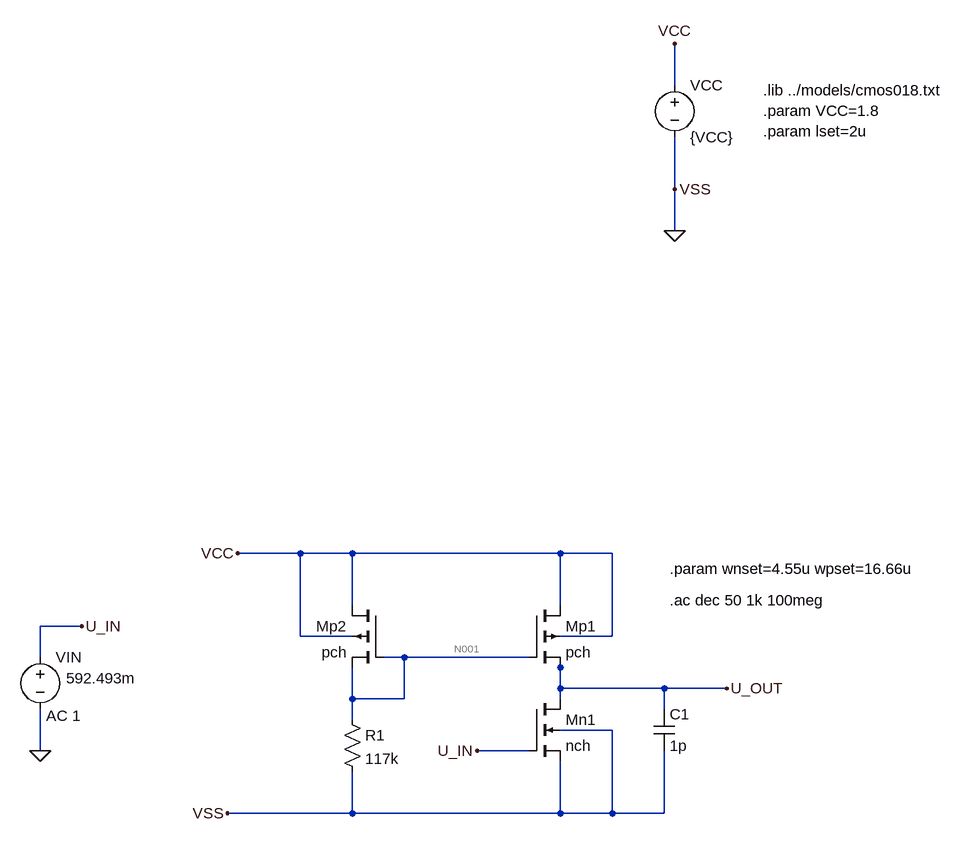
[diagram p0: schematic 4-2-2.asc]
4-2-2.asc, the LTspice schematic file:
Version 4
SHEET 1 7274800 2004
WIRE 1072 -544 1072 -608
WIRE 1072 -384 1072 -464
WIRE 1072 -320 1072 -384
WIRE 496 176 400 176
WIRE 576 176 496 176
WIRE 896 176 576 176
WIRE 976 176 896 176
WIRE 576 256 576 176
WIRE 896 256 896 176
WIRE 160 288 96 288
WIRE 496 304 496 176
WIRE 576 304 496 304
WIRE 976 304 976 176
WIRE 976 304 896 304
WIRE 96 336 96 288
WIRE 656 336 624 336
WIRE 848 336 656 336
WIRE 896 352 896 336
WIRE 896 384 896 352
WIRE 1056 384 896 384
WIRE 1152 384 1056 384
WIRE 576 400 576 352
WIRE 656 400 656 336
WIRE 656 400 576 400
WIRE 896 400 896 384
WIRE 1056 416 1056 384
WIRE 576 432 576 400
WIRE 976 448 896 448
WIRE 96 480 96 416
WIRE 848 480 768 480
WIRE 576 576 576 512
WIRE 576 576 384 576
WIRE 896 576 896 496
WIRE 896 576 576 576
WIRE 976 576 976 448
WIRE 976 576 896 576
WIRE 1056 576 1056 480
WIRE 1056 576 976 576
FLAG 1072 -320 0
FLAG 1072 -608 VCC
FLAG 400 176 VCC
FLAG 384 576 VSS
FLAG 1072 -384 VSS
FLAG 1152 384 U_OUT
FLAG 768 480 U_IN
FLAG 160 288 U_IN
FLAG 96 480 0
SYMBOL voltage 1072 -560 R0
WINDOW 123 0 0 Left 0
WINDOW 39 0 0 Left 0
SYMATTR InstName VCC
SYMATTR Value {VCC}
SYMBOL nmos4 848 400 R0
SYMATTR InstName Mn1
SYMATTR Value nch
SYMATTR Value2 l=lset w=wnset
SYMBOL res 560 416 R0
SYMATTR InstName R1
SYMATTR Value 117k
SYMBOL cap 1040 416 R0
SYMATTR InstName C1
SYMATTR Value 1p
SYMBOL voltage 96 320 R0
WINDOW 123 9 106 Left 2
WINDOW 39 0 0 Left 0
WINDOW 3 40 48 Left 2
SYMATTR Value2 AC 1
SYMATTR Value 592.493m
SYMATTR InstName VIN
SYMBOL pmos4 848 256 R0
SYMATTR InstName Mp1
SYMATTR Value pch
SYMATTR Value2 l=lset w=wpset
SYMBOL pmos4 624 256 M0
SYMATTR InstName Mp2
SYMATTR Value pch
SYMATTR Value2 l=lset w=wpset
TEXT 1208 -536 Left 2 !.lib ../models/cmos018.txt\n.param VCC=1.8\n.param lset=2u
TEXT 1064 200 Left 2 !.param wnset=4.55u wpset=16.66u
TEXT 1064 248 Left 2 !.ac dec 50 1k 100meg

The netlist it stands for:
* 4-2-2.asc
VCC VCC 0 {VCC}
Mn1 U_OUT U_IN 0 0 nch l=lset w=wnset
R1 N001 0 117k
C1 U_OUT 0 1p
VIN U_IN 0 592.493m AC 1
Mp1 VCC N001 U_OUT VCC pch l=lset w=wpset
Mp2 VCC N001 N001 VCC pch l=lset w=wpset
.model NMOS NMOS
.model PMOS PMOS
.lib standard.mos
.lib ../models/cmos018.txt
.param VCC=1.8
.param lset=2u
.param wnset=4.55u wpset=16.66u
.ac dec 50 1k 100meg
.backanno
.end

* Results of the author's LTspice run, read from the files saved beside the schematic
* Operating Point, zero values left out:
*   V(vcc) = 1.8 V
*   V(u_out) = 900 mV
*   V(u_in) = 592.5 mV
*   V(n001) = 1.19 V
*   Id(Mn1) = 10.4 µA
*   Is(Mn1) = -10.4 µA
*   Id(Mp1) = 10.4 µA
*   Is(Mp1) = -10.4 µA
*   Id(Mp2) = 10.17 µA
*   Is(Mp2) = -10.17 µA
*   I(R1) = 10.17 µA
*   I(Vcc) = -20.57 µA
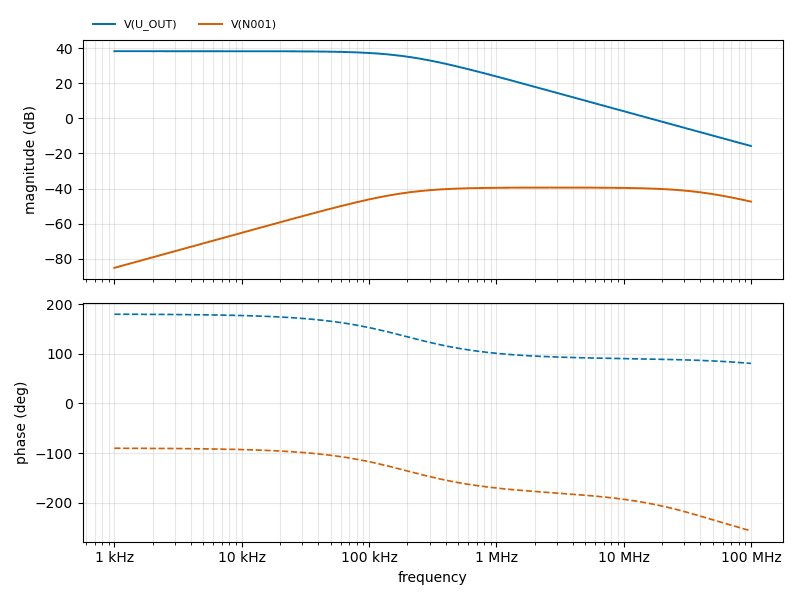
[diagram p1: AC Analysis of 4-2-2.asc, plotted from the saved traces]
* AC Analysis, 1 run:
*   V(U_OUT): 38.24 dB at 1 kHz, -15.76 dB at 100 MHz, peak 38.24 dB at 1 kHz, 3 dB below the peak at 194.4 kHz
*   V(N001): -85.19 dB at 1 kHz, -47.46 dB at 100 MHz, peak -39.45 dB at 2.884 MHz, 3 dB below the peak at 192.7 kHz and 42.98 MHz